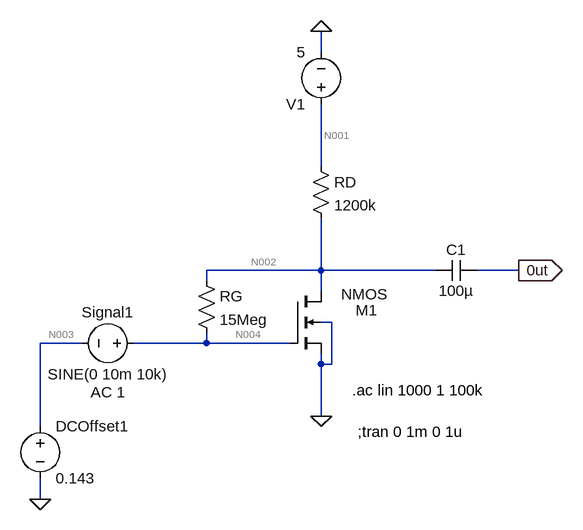
[diagram p0: schematic RG.asc]
RG.asc, the LTspice schematic file:
Version 4
SHEET 1 880 680
WIRE 272 -32 272 -64
WIRE 272 144 272 48
WIRE 272 304 272 224
WIRE 272 304 96 304
WIRE 448 304 272 304
WIRE 576 304 512 304
WIRE 96 320 96 304
WIRE 272 336 272 304
WIRE 288 384 272 384
WIRE -96 416 -160 416
WIRE 96 416 96 400
WIRE 96 416 -16 416
WIRE 224 416 96 416
WIRE 272 448 272 432
WIRE 288 448 288 384
WIRE 288 448 272 448
WIRE 272 528 272 448
WIRE -160 544 -160 416
WIRE -160 656 -160 624
FLAG 576 304 0ut
IOPIN 576 304 Out
FLAG 272 -64 0
FLAG 272 528 0
FLAG -160 656 0
SYMBOL res 256 128 R0
SYMATTR InstName RD
SYMATTR Value 1200k
SYMBOL nmos4 224 336 R0
WINDOW 0 101 29 Left 2
WINDOW 3 79 5 Left 2
SYMATTR InstName M1
SYMATTR Value2 l=0.18u w=1.8u
SYMBOL voltage 272 64 R180
WINDOW 123 0 0 Left 0
WINDOW 39 0 0 Left 0
SYMATTR InstName V1
SYMATTR Value 5
SYMBOL voltage -160 528 R0
WINDOW 123 0 0 Left 0
WINDOW 39 0 0 Left 0
SYMATTR InstName DCOffset1
SYMATTR Value 0.143
SYMBOL voltage 0 416 R90
WINDOW 0 -32 56 VBottom 2
WINDOW 3 32 56 VTop 2
WINDOW 123 60 56 VTop 2
WINDOW 39 0 0 Left 0
SYMATTR InstName Signal1
SYMATTR Value SINE(0 10m 10k)
SYMATTR Value2 AC 1
SYMBOL cap 512 288 R90
WINDOW 0 0 32 VBottom 2
WINDOW 3 32 32 VTop 2
SYMATTR InstName C1
SYMATTR Value 100µ
SYMBOL res 80 304 R0
SYMATTR InstName RG
SYMATTR Value 15Meg
TEXT 320 488 Left 2 !.ac lin 1000 1 100k
TEXT 328 552 Left 2 !;tran 0 1m 0 1u

The netlist it stands for:
* RG.asc
RD N001 N002 1200k
M1 N002 N004 0 0 NMOS l=0.18u w=1.8u
V1 N001 0 5
V§DCOffset1 N003 0 0.143
V§Signal1 N004 N003 SINE(0 10m 10k) AC 1
C1 0ut N002 100µ
RG N002 N004 15Meg
.model NMOS NMOS
.model PMOS PMOS
.lib standard.mos
.ac lin 1000 1 100k
;tran 0 1m 0 1u
.backanno
.end

* Results of the author's LTspice run, read from the files saved beside the schematic
* Operating Point, zero values left out:
*   V(n001) = 5 V
*   V(n002) = 2.368 V
*   V(n004) = 143 mV
*   V(n003) = 143 mV
*   V(0ut) = 236.8 µV
*   Id(M1) = 2.045 µA
*   Ib(M1) = -2.378 pA
*   Is(M1) = -2.045 µA
*   I(Rg) = 148.3 nA
*   I(Rd) = 2.193 µA
*   I(Signal1) = 148.3 nA
*   I(Dcoffset1) = 148.3 nA
*   I(V1) = -2.193 µA